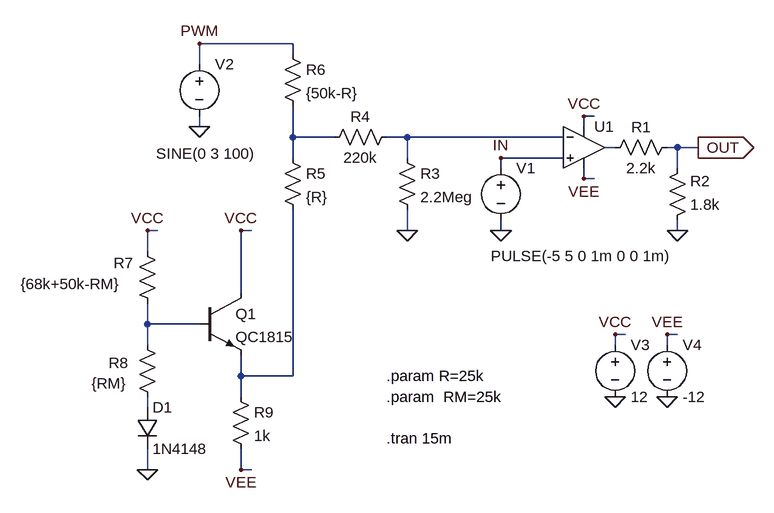
[diagram p0: schematic Saw2Sqr_PWM_Analog2_0.asc]
Saw2Sqr_PWM_Analog2_0.asc, the LTspice schematic file:
Version 4
SHEET 1 880 776
WIRE -208 -16 -352 -16
WIRE -208 0 -208 -16
WIRE -352 16 -352 -16
WIRE 256 96 240 96
WIRE -352 112 -352 96
WIRE 240 112 240 96
WIRE -208 128 -208 80
WIRE -144 128 -208 128
WIRE -32 128 -64 128
WIRE 208 128 -32 128
WIRE 288 144 272 144
WIRE 384 144 368 144
WIRE 416 144 384 144
WIRE -208 160 -208 128
WIRE -32 160 -32 128
WIRE 208 160 112 160
WIRE 112 176 112 160
WIRE 384 176 384 144
WIRE 240 192 240 176
WIRE 256 192 240 192
WIRE -416 272 -432 272
WIRE -272 272 -288 272
WIRE -32 272 -32 240
WIRE 112 272 112 256
WIRE 384 272 384 256
WIRE -432 304 -432 272
WIRE -288 368 -288 272
WIRE -432 416 -432 384
WIRE -352 416 -432 416
WIRE 304 432 288 432
WIRE 384 432 368 432
WIRE -432 448 -432 416
WIRE 288 448 288 432
WIRE 368 448 368 432
WIRE -288 496 -288 464
WIRE -208 496 -208 240
WIRE -208 496 -288 496
WIRE -288 528 -288 496
WIRE -432 544 -432 528
WIRE -432 640 -432 608
WIRE -288 640 -288 608
WIRE -272 640 -288 640
FLAG 240 96 VCC
FLAG 240 192 VEE
FLAG 112 272 0
FLAG 384 272 0
FLAG 416 144 OUT
IOPIN 416 144 Out
FLAG -352 112 0
FLAG 288 528 0
FLAG 368 528 0
FLAG 288 432 VCC
FLAG 368 432 VEE
FLAG -352 -16 PWM
FLAG 112 160 IN
FLAG -32 272 0
FLAG -432 640 0
FLAG -432 272 VCC
FLAG -288 272 VCC
FLAG -288 640 VEE
SYMBOL Opamps\\UniversalOpamp2 240 144 R0
SYMATTR InstName U1
SYMBOL voltage 112 160 R0
WINDOW 3 -15 151 Left 2
WINDOW 123 0 0 Left 0
WINDOW 39 0 0 Left 0
SYMATTR Value PULSE(-5 5 0 1m 0 0 1m)
SYMATTR InstName V1
SYMBOL res 384 128 R90
WINDOW 0 0 56 VBottom 2
WINDOW 3 32 56 VTop 2
SYMATTR InstName R1
SYMATTR Value 2.2k
SYMBOL res 368 272 M180
WINDOW 0 36 76 Left 2
WINDOW 3 36 40 Left 2
SYMATTR InstName R2
SYMATTR Value 1.8k
SYMBOL voltage -352 0 R0
WINDOW 3 -67 153 Left 2
WINDOW 123 0 0 Left 0
WINDOW 39 0 0 Left 0
SYMATTR Value SINE(0 3 100)
SYMATTR InstName V2
SYMBOL voltage 288 432 R0
WINDOW 123 0 0 Left 0
WINDOW 39 0 0 Left 0
SYMATTR InstName V3
SYMATTR Value 12
SYMBOL voltage 368 432 R0
WINDOW 123 0 0 Left 0
WINDOW 39 0 0 Left 0
SYMATTR InstName V4
SYMATTR Value -12
SYMBOL res -48 144 R0
SYMATTR InstName R3
SYMATTR Value 2.2Meg
SYMBOL res -48 112 R90
WINDOW 0 0 56 VBottom 2
WINDOW 3 32 56 VTop 2
SYMATTR InstName R4
SYMATTR Value 220k
SYMBOL res -224 144 R0
SYMATTR InstName R5
SYMATTR Value {R}
SYMBOL res -224 -16 R0
SYMATTR InstName R6
SYMATTR Value {50k-R}
SYMBOL res -448 288 R0
WINDOW 0 -36 34 Left 2
WINDOW 3 -179 66 Left 2
SYMATTR InstName R7
SYMATTR Value {68k+50k-RM}
SYMBOL res -448 432 R0
WINDOW 0 -44 44 Left 2
WINDOW 3 -70 75 Left 2
SYMATTR InstName R8
SYMATTR Value {RM}
SYMBOL diode -448 544 R0
SYMATTR InstName D1
SYMATTR Value 1N4148
SYMBOL npn -352 368 R0
SYMATTR InstName Q1
SYMATTR Value QC1815
SYMBOL res -304 512 R0
SYMATTR InstName R9
SYMATTR Value 1k
TEXT -64 592 Left 2 !.tran 15m
TEXT -64 496 Left 2 !.param R=25k
TEXT -64 528 Left 2 !.param  RM=25k

The netlist it stands for:
* Saw2Sqr_PWM_Analog2_0.asc
XU1 IN N002 VCC VEE N003 level.2 Avol=1Meg GBW=10Meg Slew=10Meg ilimit=25m rail=0 Vos=0 phimargin=45 en=0 enk=0 in=0 ink=0 Rin=500Meg  ; pins IN+ IN- V+ V- OUT
V1 IN 0 PULSE(-5 5 0 1m 0 0 1m)
R1 OUT N003 2.2k
R2 0 OUT 1.8k
V2 PWM 0 SINE(0 3 100)
V3 VCC 0 12
V4 VEE 0 -12
R3 N002 0 2.2Meg
R4 N002 N001 220k
R5 N001 N005 {R}
R6 PWM N001 {50k-R}
R7 VCC N004 {68k+50k-RM}
R8 N004 N006 {RM}
D1 N006 0 1N4148
Q1 VCC N004 N005 0 QC1815
R9 N005 VEE 1k
.model D D
.lib standard.dio
.model NPN NPN
.model PNP PNP
.lib standard.bjt
.tran 15m
.param R=25k
.param  RM=25k
.lib UniversalOpamps2.sub
.backanno
.end